# Altium schematic sheet LAN8830_PINOUT.SchDoc
size C; SheetNumber: 2; SheetTotal: 5
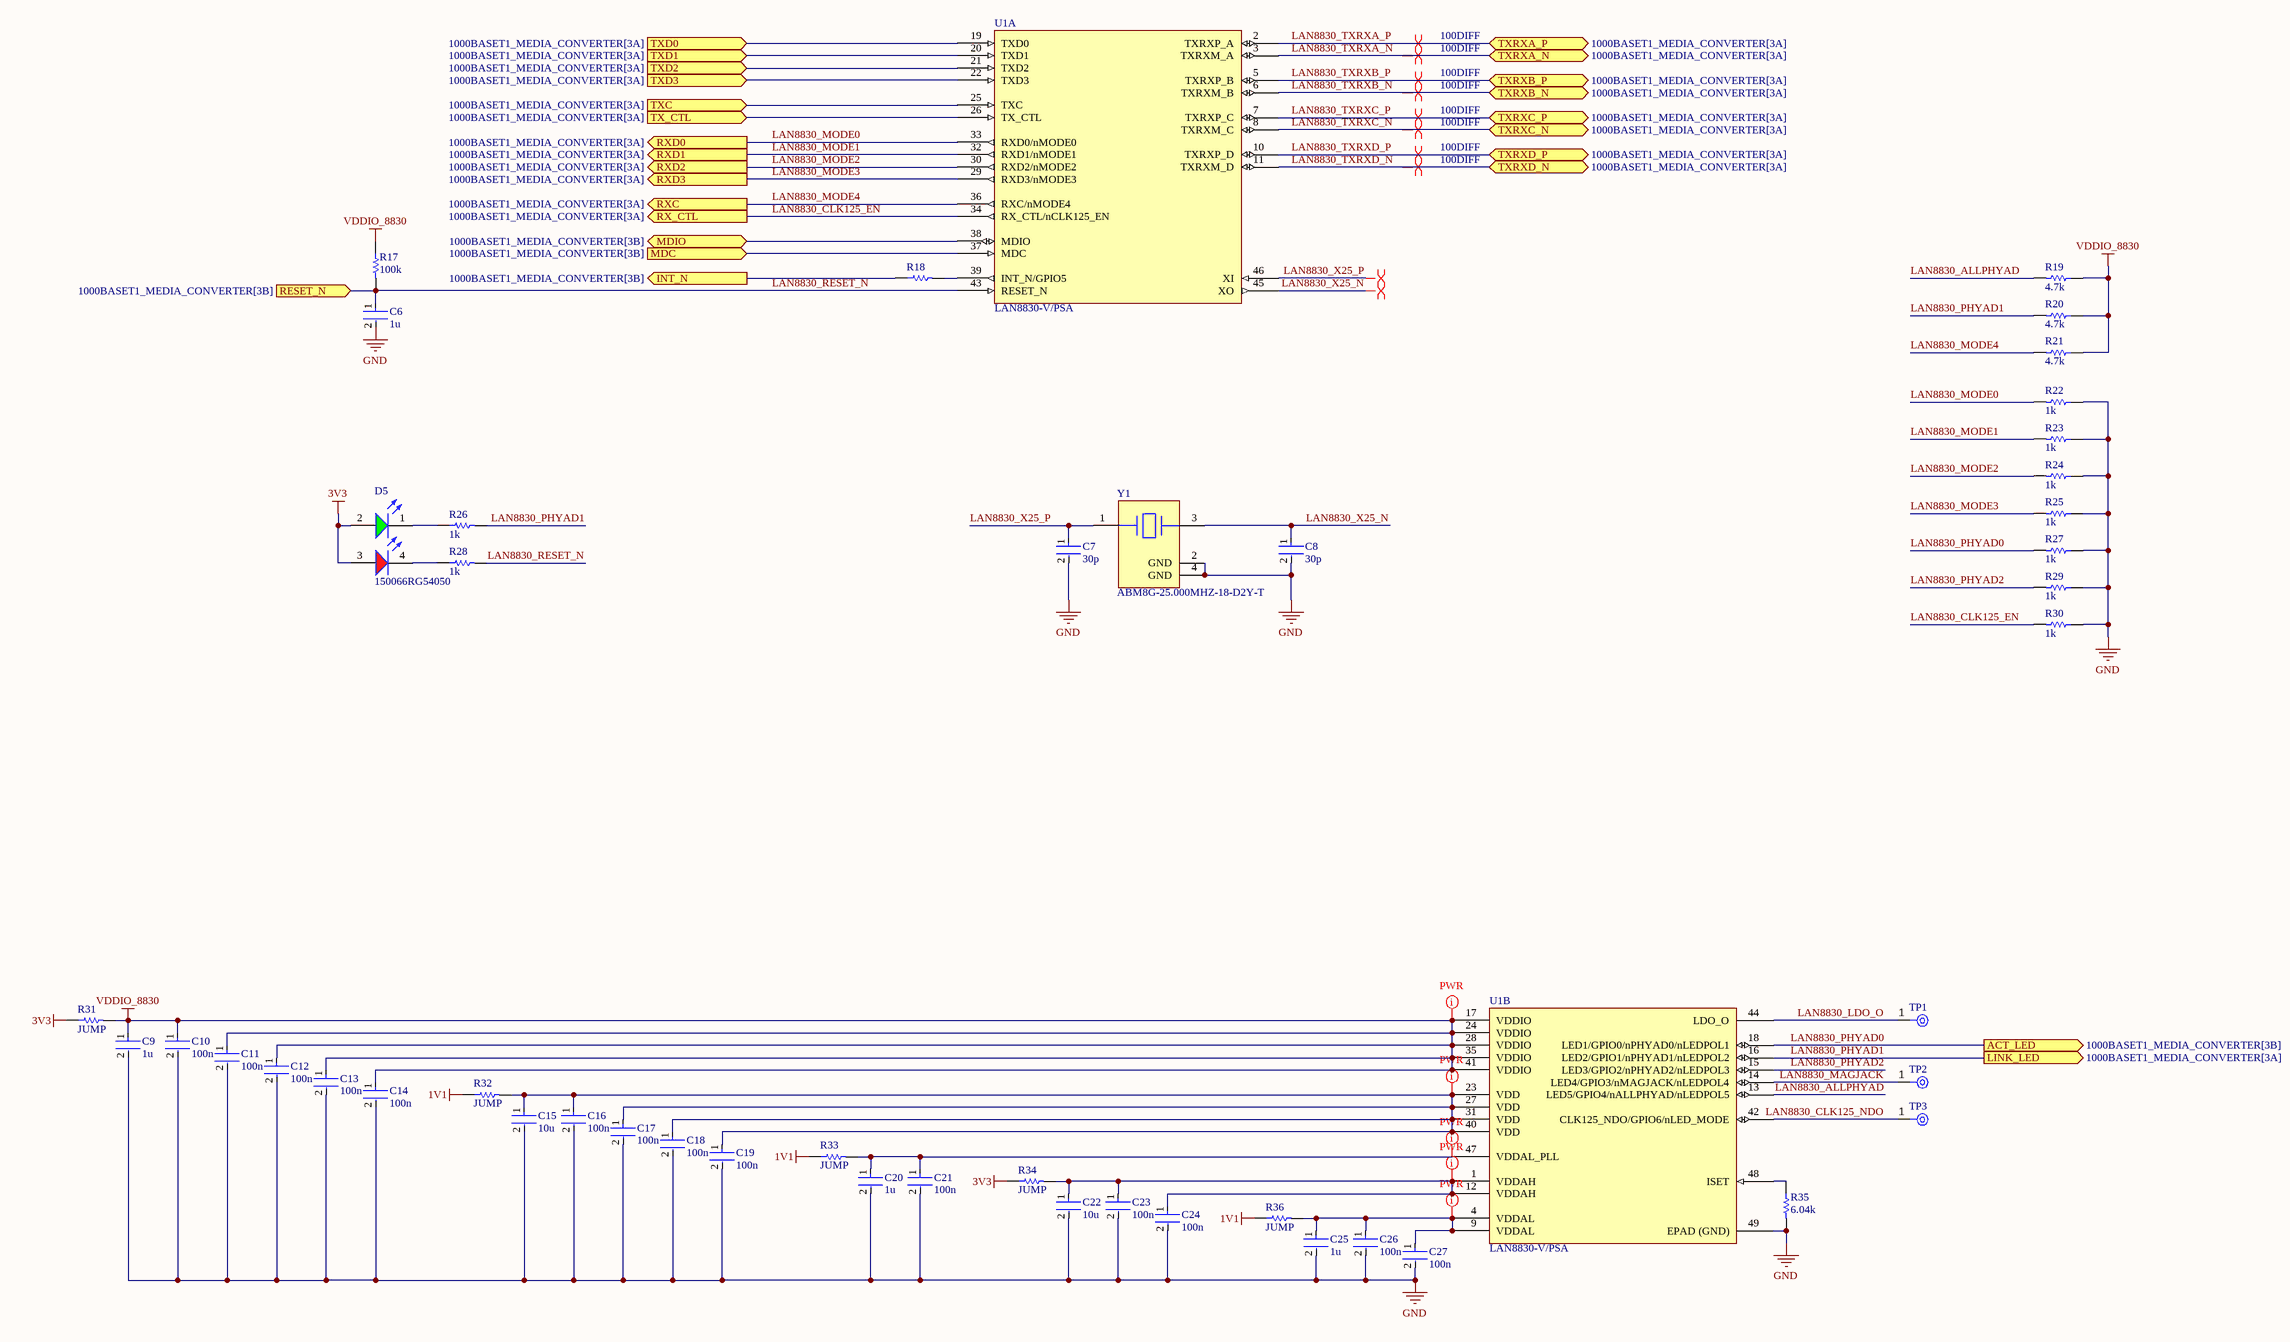
[diagram p0: LAN8830_PINOUT.SchDoc]

## Parts
C6  1u  [FP-0402-L_1_0_0_05-W_0_5-IPC_A]
C7  30p  [FP-0402-L_1_0_0_05-W_0_5-IPC_A]
C8  30p  [FP-0402-L_1_0_0_05-W_0_5-IPC_A]
C9  1u  [FP-0402-L_1_0_0_05-W_0_5-IPC_A]
C10  100n  [FP-0402-L_1_0_0_05-W_0_5-IPC_A]
C11  100n  [FP-0402-L_1_0_0_05-W_0_5-IPC_A]
C12  100n  [FP-0402-L_1_0_0_05-W_0_5-IPC_A]
C13  100n  [FP-0402-L_1_0_0_05-W_0_5-IPC_A]
C14  100n  [FP-0402-L_1_0_0_05-W_0_5-IPC_A]
C15  10u  [FP-0402-L_1_0_0_05-W_0_5-IPC_A]
C16  100n  [FP-0402-L_1_0_0_05-W_0_5-IPC_A]
C17  100n  [FP-0402-L_1_0_0_05-W_0_5-IPC_A]
C18  100n  [FP-0402-L_1_0_0_05-W_0_5-IPC_A]
C19  100n  [FP-0402-L_1_0_0_05-W_0_5-IPC_A]
C20  1u  [FP-0402-L_1_0_0_05-W_0_5-IPC_A]
C21  100n  [FP-0402-L_1_0_0_05-W_0_5-IPC_A]
C22  10u  [FP-0402-L_1_0_0_05-W_0_5-IPC_A]
C23  100n  [FP-0402-L_1_0_0_05-W_0_5-IPC_A]
C24  100n  [FP-0402-L_1_0_0_05-W_0_5-IPC_A]
C25  1u  [FP-0402-L_1_0_0_05-W_0_5-IPC_A]
C26  100n  [FP-0402-L_1_0_0_05-W_0_5-IPC_A]
C27  100n  [FP-0402-L_1_0_0_05-W_0_5-IPC_A]
D5  150066RG54050  [WL-SBCD_0606]
R17  100k  [R0603B]
R18  0402 JUMPER  [RESC1005X40X25ML05T05]  (value not drawn)
R19  4.7k  [R0603B]
R20  4.7k  [R0603B]
R21  4.7k  [R0603B]
R22  1k  [R0603B]
R23  1k  [R0603B]
R24  1k  [R0603B]
R25  1k  [R0603B]
R26  1k  [R0603B]
R27  1k  [R0603B]
R28  1k  [R0603B]
R29  1k  [R0603B]
R30  1k  [R0603B]
R31  JUMP  [R0603B]
R32  JUMP  [R0603B]
R33  JUMP  [R0603B]
R34  JUMP  [R0603B]
R35  6.04k  [R0603B]
R36  JUMP  [R0603B]
TP1  TPAD6R  [New footprint 1]  (value not drawn)  (no BOM)
TP2  TPAD6R  [New footprint 1]  (value not drawn)  (no BOM)
TP3  TPAD6R  [New footprint 1]  (value not drawn)  (no BOM)
U1  LAN8830-V/PSA  [QFN50P700X700X100_HS-49N]  (parts A,B of 2)
Y1  ABM8G-25.000MHZ-18-D2Y-T  [FP-ABM8G-MFG]

## Ports
ACT_LED (out, see 1000BASET1_MEDIA_CONVERTER[3B]), INT_N (out, see 1000BASET1_MEDIA_CONVERTER[3B]), LINK_LED (out, see 1000BASET1_MEDIA_CONVERTER[3A]), MDC (in, see 1000BASET1_MEDIA_CONVERTER[3B]), MDIO (bidir, see 1000BASET1_MEDIA_CONVERTER[3B]), RESET_N (in, see 1000BASET1_MEDIA_CONVERTER[3B]), RX_CTL (out, see 1000BASET1_MEDIA_CONVERTER[3A]), RXC (out, see 1000BASET1_MEDIA_CONVERTER[3A]), RXD0 (out, see 1000BASET1_MEDIA_CONVERTER[3A]), RXD1 (out, see 1000BASET1_MEDIA_CONVERTER[3A]), RXD2 (out, see 1000BASET1_MEDIA_CONVERTER[3A]), RXD3 (out, see 1000BASET1_MEDIA_CONVERTER[3A]), TX_CTL (in, see 1000BASET1_MEDIA_CONVERTER[3A]), TXC (in, see 1000BASET1_MEDIA_CONVERTER[3A]), TXD0 (in, see 1000BASET1_MEDIA_CONVERTER[3A]), TXD1 (in, see 1000BASET1_MEDIA_CONVERTER[3A]), TXD2 (in, see 1000BASET1_MEDIA_CONVERTER[3A]), TXD3 (in, see 1000BASET1_MEDIA_CONVERTER[3A]), TXRXA_N (bidir, see 1000BASET1_MEDIA_CONVERTER[3A]), TXRXA_P (bidir, see 1000BASET1_MEDIA_CONVERTER[3A]), TXRXB_N (bidir, see 1000BASET1_MEDIA_CONVERTER[3A]), TXRXB_P (bidir, see 1000BASET1_MEDIA_CONVERTER[3A]), TXRXC_N (bidir, see 1000BASET1_MEDIA_CONVERTER[3A]), TXRXC_P (bidir, see 1000BASET1_MEDIA_CONVERTER[3A]), TXRXD_N (bidir, see 1000BASET1_MEDIA_CONVERTER[3A]), TXRXD_P (bidir, see 1000BASET1_MEDIA_CONVERTER[3A])

## Nets
1V1: R32.1 R33.1 R36.1
3V3: D5.2(A) D5.3(A) R31.1 R34.1
GND: C6.2 C7.2 C8.2 C9.2 C10.2 C11.2 C12.2 C13.2 C14.2 C15.2 C16.2 C17.2 C18.2 C19.2 C20.2 C21.2 C22.2 C23.2 C24.2 C25.2 C26.2 C27.2 R22.1 R23.1 R24.1 R25.1 R27.1 R29.1 R30.1 R35.2 U1.49(EPAD_(GND)) Y1.2(GND) Y1.4(GND)
VDDIO_8830: C9.1 C10.1 C11.1 C12.1 C13.1 C14.1 R17.1 R19.1 R20.1 R21.1 R31.2 U1.17(VDDIO) U1.24(VDDIO) U1.28(VDDIO) U1.35(VDDIO) U1.41(VDDIO)
INT_N: R18.1 ; port INT_N
LAN8830_ALLPHYAD: R19.2 U1.13(LED5/GPIO4/nALLPHYAD/nLEDPOL5)
LAN8830_CLK125_EN: R30.2 U1.34(RX_CTL/nCLK125_EN) ; port RX_CTL
LAN8830_CLK125_NDO: TP3.1(TP) U1.42(CLK125_NDO/GPIO6/nLED_MODE)
LAN8830_LDO_O: TP1.1(TP) U1.44(LDO_O)
LAN8830_MAGJACK: TP2.1(TP) U1.14(LED4/GPIO3/nMAGJACK/nLEDPOL4)
LAN8830_MODE0: R22.2 U1.33(RXD0/nMODE0) ; port RXD0
LAN8830_MODE1: R23.2 U1.32(RXD1/nMODE1) ; port RXD1
LAN8830_MODE2: R24.2 U1.30(RXD2/nMODE2) ; port RXD2
LAN8830_MODE3: R25.2 U1.29(RXD3/nMODE3) ; port RXD3
LAN8830_MODE4: R21.2 U1.36(RXC/nMODE4) ; port RXC
LAN8830_PHYAD0: R27.2 U1.18(LED1/GPIO0/nPHYAD0/nLEDPOL1) ; port ACT_LED
LAN8830_PHYAD1: R20.2 R26.2 U1.16(LED2/GPIO1/nPHYAD1/nLEDPOL2) ; port LINK_LED
LAN8830_PHYAD2: R29.2 U1.15(LED3/GPIO2/nPHYAD2/nLEDPOL3)
LAN8830_RESET_N: C6.1 R17.2 R28.2 U1.43(RESET_N) ; port RESET_N
LAN8830_TXRXA_N: U1.3(TXRXM_A) ; port TXRXA_N
LAN8830_TXRXA_P: U1.2(TXRXP_A) ; port TXRXA_P
LAN8830_TXRXB_N: U1.6(TXRXM_B) ; port TXRXB_N
LAN8830_TXRXB_P: U1.5(TXRXP_B) ; port TXRXB_P
LAN8830_TXRXC_N: U1.8(TXRXM_C) ; port TXRXC_N
LAN8830_TXRXC_P: U1.7(TXRXP_C) ; port TXRXC_P
LAN8830_TXRXD_N: U1.11(TXRXM_D) ; port TXRXD_N
LAN8830_TXRXD_P: U1.10(TXRXP_D) ; port TXRXD_P
LAN8830_X25_N: C8.1 U1.45(XO) Y1.3
LAN8830_X25_P: C7.1 U1.46(XI) Y1.1
MDC: U1.37(MDC) ; port MDC
MDIO: U1.38(MDIO) ; port MDIO
TX_CTL: U1.26(TX_CTL) ; port TX_CTL
TXC: U1.25(TXC) ; port TXC
TXD0: U1.19(TXD0) ; port TXD0
TXD1: U1.20(TXD1) ; port TXD1
TXD2: U1.21(TXD2) ; port TXD2
TXD3: U1.22(TXD3) ; port TXD3
NetC15_1: C15.1 C16.1 C17.1 C18.1 C19.1 R32.2 U1.23(VDD) U1.27(VDD) U1.31(VDD) U1.40(VDD)
NetC20_1: C20.1 C21.1 R33.2 U1.47(VDDAL_PLL)
NetC22_1: C22.1 C23.1 C24.1 R34.2 U1.1(VDDAH) U1.12(VDDAH)
NetC25_1: C25.1 C26.1 C27.1 R36.2 U1.4(VDDAL) U1.9(VDDAL)
NetD5_1: D5.1(K) R26.1
NetD5_4: D5.4(K) R28.1
NetR18_2: R18.2 U1.39(INT_N/GPIO5)
NetR35_1: R35.1 U1.48(ISET)

## Layout directives
differential pair; differential pair class 100DIFF: LAN8830_TXRXA_N, LAN8830_TXRXA_P, LAN8830_TXRXB_N, LAN8830_TXRXB_P, LAN8830_TXRXC_N, LAN8830_TXRXC_P, LAN8830_TXRXD_N, LAN8830_TXRXD_P
differential pair: LAN8830_X25_N, LAN8830_X25_P
net class PWR: NetC15_1, NetC20_1, NetC22_1, NetC25_1, VDDIO_8830

## Library data of the parts
C6-C27 = CMP-001-00058-1: LARGE PADS, 0402 CAP, CHANGE COMMENT TO MATCH REAL P/N; Capacitor Type: Ceramic; Min Operating Temperature: -55°C; Mounting Technology: Surface Mount; Pins: 2; Case/Package: 0402; RoHS Compliant: Yes; Max Operating Temperature: 85°C
D5 = CMP-004-00040-2: Led, Red/Grn, 180Mcd/230Mcd, 624Nm/525Nm Rohs Compliant: Yes; Source: rgled.SchLib; Component Type: Standard; Design Item ID: CMP-004-00034-2; Pins: 4
R17 R19-R30 R35 = CMP-009-00002-14: Resistor
  R17: Value: 100k
  R19-R21: Value: 4.7k
  R22-R30: Value: 1k
  R35: Value: 6.04k
R18 = CMP-009-00118-2: READ THE NAME; Pins: 2; Component Type: Standard; Design Item ID: CMP-009-00206-2; Source: 0402jump.SchLib
R31-R34 R36 = CMP-009-00002-14: Resistor; Value: 0
TP1-TP3 = CMP-00025-3: Test Point .6mm
U1 = CMP-015-00022-4: LAN8830 Series RGMII Interface Gigabit Ethernet Transceiver - VQFN-48; Case/Package: VQFN; Pins: 48
Y1 = CMP-2000-05733-3: Crystal 25MHz ±20ppm (Tol) ±30ppm (Stability) 18pF FUND 60Ω 4-Pin SMD T/R; Series Resistance: 60R; Length: 3.2mm; Depth: 2.5mm; Packaging: Tape and Reel; Min Operating Temperature: -40°C; Operating Frequency: 25 MHz; Lead Free: Lead Free; Number of Pins: 4; Frequency Tolerance: 20ppm; Radiation Hardening: No; Max Operating Temperature: 85°C; Termination: SMD/SMT; Frequency Stability: 30ppm; Frequency: 25MHz; Series: ABM8G; Mount: Surface Mount; Package Quantity: 1000; Height: 0.039inch; Width: 0.098inch; Case/Package: CSMD; ESR (Equivalent Series Resistance): 60R; Load Capacitance: 18pF; Tolerance: 20ppm